# EAGLE schematic freq_counter_WB_group7 (EAGLE 9.2.1)
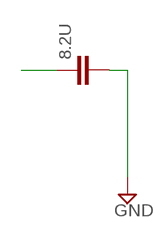
[diagram p0: schematic, sheet 1]

## Parts
8.2U  C2,5-3  [C2.5-3]

## Nets
GND: 8.2U.2
N$1: 8.2U.1

## Library data of the parts
8.2U = capacitor-wima:C: CAPACITOR naming: grid - package width